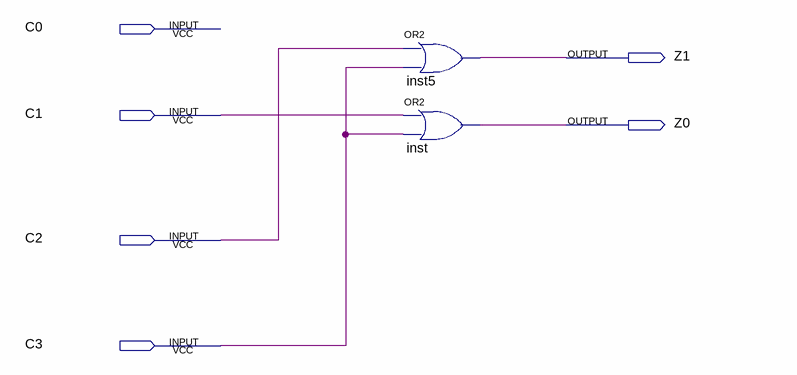
[diagram p0: schematic sheet]
// Quartus schematic cd4.bdf as structural Verilog: 2 symbols, 6 pins
module cd4 (
  input  C0,
  input  C1,
  input  C2,
  input  C3,
  output Z1,
  output Z0
);

  or inst5 (Z1, C2, C3);
  or inst (Z0, C1, C3);
endmodule
